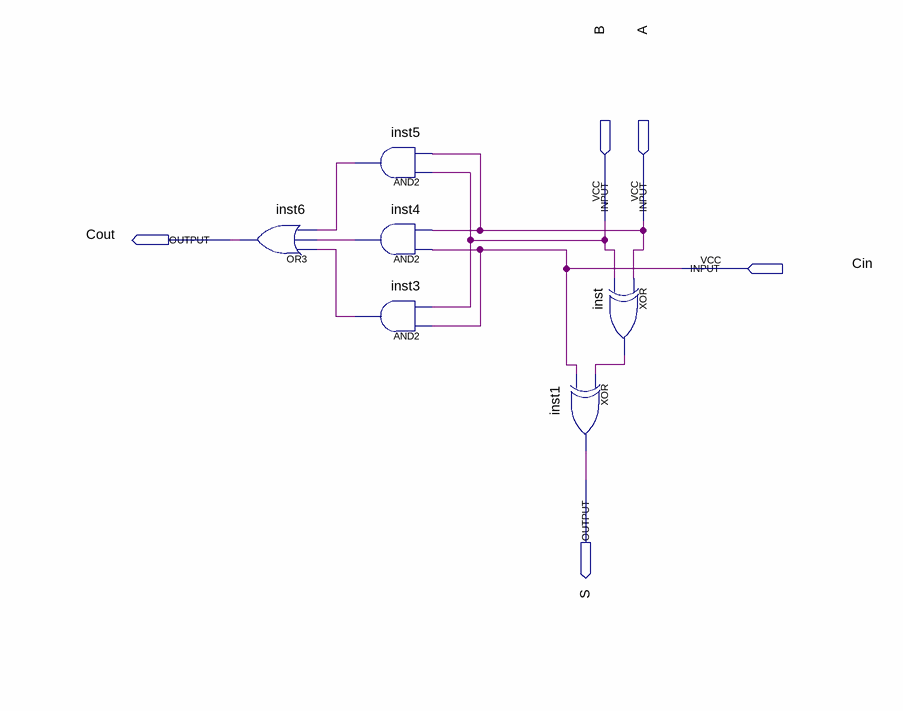
[diagram p0: schematic sheet]
// Quartus schematic soma.bdf as structural Verilog: 6 symbols, 5 pins
module soma (
  input  B,
  input  A,
  input  Cin,
  output Cout,
  output S
);

  wire inst3_out, inst4_out, inst5_out, inst_out;

  or inst6 (Cout, inst3_out, inst4_out, inst5_out);
  and inst5 (inst5_out, B, A);
  and inst4 (inst4_out, Cin, A);
  and inst3 (inst3_out, Cin, B);
  xor inst (inst_out, A, B);
  xor inst1 (S, inst_out, Cin);
endmodule
